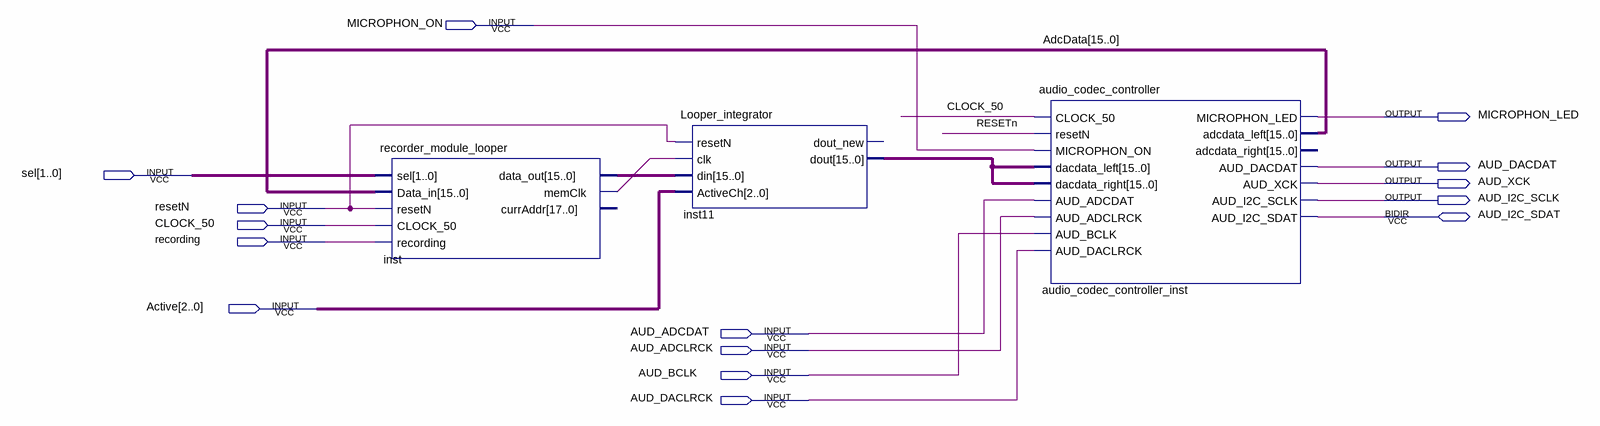
[diagram p0: schematic sheet]
// Quartus schematic experiment_digital_recorder.bdf as structural Verilog: 3 symbols, 15 pins
module experiment_digital_recorder (
  input  MICROPHON_ON,
  input  [1:0] sel,
  input  resetN,
  input  CLOCK_50,
  input  recording,
  input  [2:0] Active,
  input  AUD_ADCDAT,
  input  AUD_ADCLRCK,
  input  AUD_BCLK,
  input  AUD_DACLRCK,
  inout  AUD_I2C_SDAT,
  output MICROPHON_LED,
  output AUD_DACDAT,
  output AUD_XCK,
  output AUD_I2C_SCLK
);

  wire inst_memclk;
  wire [15:0] AdcData, inst11_dout, inst_data_out;

  recorder_module_looper inst (
    .sel(sel), .Data_in(AdcData), .resetN(resetN), .CLOCK_50(CLOCK_50), .recording(recording),
    .data_out(inst_data_out), .memClk(inst_memclk));  // open: currAddr
  Looper_integrator inst11 (
    .resetN(resetN), .clk(inst_memclk), .din(inst_data_out), .ActiveCh(Active), .dout(inst11_dout));  // open: dout_new
  audio_codec_controller audio_codec_controller_inst (
    .CLOCK_50(CLOCK_50), .resetN(resetN), .MICROPHON_ON(MICROPHON_ON), .dacdata_left(inst11_dout),
    .dacdata_right(inst11_dout), .AUD_ADCDAT(AUD_ADCDAT), .AUD_ADCLRCK(AUD_ADCLRCK), .AUD_BCLK(AUD_BCLK),
    .AUD_DACLRCK(AUD_DACLRCK), .MICROPHON_LED(MICROPHON_LED), .adcdata_left(AdcData),
    .AUD_DACDAT(AUD_DACDAT), .AUD_XCK(AUD_XCK), .AUD_I2C_SCLK(AUD_I2C_SCLK), .AUD_I2C_SDAT(AUD_I2C_SDAT));  // open: adcdata_right
endmodule
